# EAGLE design gertduino shield (EAGLE 7.5.0)
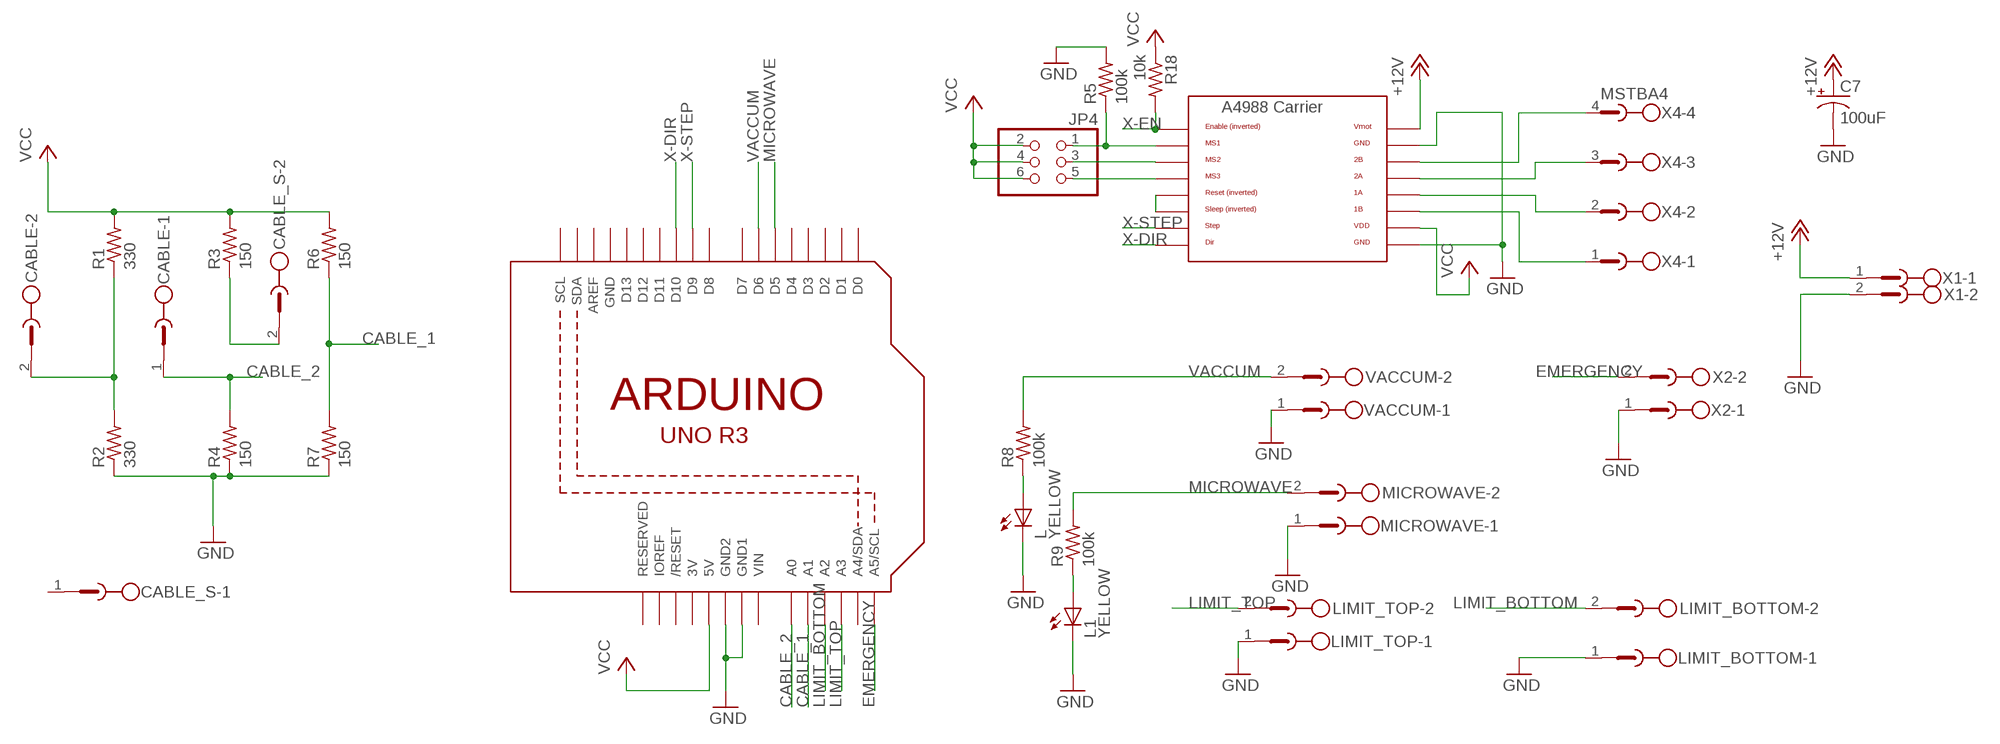
[diagram p0: schematic, sheet 1]

## Parts
C7  100uF  CPOL-US153CLV-0605  [153CLV-0605]
CABLE  MSTBV2  [MSTBV2]
CABLE_S  MSTBV2  [MSTBV2]
JP4  PINHD-2X3  [2X03]
L  YELLOW  LEDCHIP-LED0805  [CHIP-LED0805]
L1  YELLOW  LEDCHIP-LED0805  [CHIP-LED0805]
LIMIT_BOTTOM  MSTBV2  [MSTBV2]
LIMIT_TOP  MSTBV2  [MSTBV2]
MICROWAVE  MSTBV2  [MSTBV2]
R1  330  R-US_M0805  [M0805]
R2  330  R-US_M0805  [M0805]
R3  150  R-US_M0805  [M0805]
R4  150  R-US_M0805  [M0805]
R5  100k  R-US_R0805  [R0805]
R6  150  R-US_M0805  [M0805]
R7  150  R-US_M0805  [M0805]
R8  100k  R-US_R0805  [R0805]
R9  100k  R-US_R0805  [R0805]
R18  10k  R-US_R0805  [R0805]
U1  ARDUINOR3-DIMENSION  [ARDUINOR3]
U$6  A4988BREAKOUT  [A4988BREAKOUT]
VACCUM  MSTBV2  [MSTBV2]
X1  MSTBV2  [MSTBV2]
X2  MSTBV2  [MSTBV2]
X4  MSTBA4  [MSTBA4]

## Nets
+12V: C7.+ U$6.VMOT X1.1
CABLE_1: R6.1 R7.2 U1.A1
CABLE_2: CABLE.1 R4.2 U1.A0
EMERGENCY: U1.A5(A5/SCL) X2.2
GND: C7.- L1.C L.C LIMIT_BOTTOM.1 LIMIT_TOP.1 MICROWAVE.1 R2.1 R4.1 R5.2 R7.1 U1.GND1 U1.GND2 U$6.GND U$6.GND@0(GND) VACCUM.1 X1.2 X2.1
LIMIT_BOTTOM: LIMIT_BOTTOM.2 U1.A2
LIMIT_TOP: LIMIT_TOP.2 U1.A3
MICROWAVE: MICROWAVE.2 R9.2 U1.D5
N$1: L.A R8.1
N$2: L1.A R9.1
N$3: CABLE.2 R1.1 R2.2
N$5: CABLE_S.2 R3.1
N$14: JP4.1 R5.1 U$6.MS1
N$15: JP4.3 U$6.MS2
N$19: JP4.5 U$6.MS3
N$20: U$6.RST U$6.SLP(SLEEP)
N$21: U$6.2B X4.4
N$22: U$6.2A X4.3
N$26: U$6.1A X4.2
N$27: U$6.1B X4.1
VACCUM: R8.2 U1.D6 VACCUM.2
VCC: JP4.2 JP4.4 JP4.6 R1.2 R3.2 R6.2 R18.1 U1.5V U$6.VDD
X-DIR: U1.D10 U$6.DIR
X-EN: R18.2 U$6.EN
X-STEP: U1.D9 U$6.STEP
Unconnected: CABLE_S.1 U1.A4(A4/SDA) U1.AREF U1.D0 U1.D1 U1.D2 U1.D3 U1.D4 U1.D7 U1.D8 U1.D11 U1.D12 U1.D13 U1.IOREF U1.RESERVED U1.RESET(/RESET) U1.SCL U1.SDA

## Notes on the sheet
- X

## Power pins joined to a net without a drawn wire
3V: U1.3V
GND: U1.GND
VIN: U1.VIN

## Library data of the parts
C7 = adafruit:CPOL-US: POLARIZED CAPACITOR, American symbol
CABLE CABLE_S LIMIT_BOTTOM LIMIT_TOP MICROWAVE VACCUM X1 X2 = con-phoenix-500:MSTBV2: PHOENIX; OC_FARNELL: unknown; OC_NEWARK: unknown
JP4 = pinhead:PINHD-2X3: PIN HEADER
L L1 = led:LED: LED OSRAM: - CHIPLED LG R971, LG N971, LY N971, LG Q971, LY Q971, LO R971, LY R971 LH N974, LH R974 LS Q976, LO Q976, LY Q976 LO Q996 - Hyper CHIPLED LW Q18S LB Q993, LB Q99A, LB R99A - SideLED LS A670, LO A670, LY A670, LG A670, LP A670 LB A673, LV A673, LT A673, LW A673 LH A674 LY A675 LS A676, LA A676, LO A676, LY A676, LW A676 LS A679, LY A679, LG A679 - Hyper Micro SIDELED® LS Y876, LA Y876, LO Y876, LY Y876 LT Y87S - SmartLED LW L88C, LW L88S LB L89C, LB L89S, LG L890 LS L89K, LO L89K, LY L89K LS L896, LA L896, LO L896, LY L896 - TOPLED LS T670, LO T670, LY T670, LG T670, LP T670 LSG T670, LSP T670, LSY T670, LOP T670, LYG T670 LG T671, LOG T671, LSG T671 LB T673, LV T673, LT T673, LW T673 LH T674 LS T676, LA T676, LO T676, LY T676, LB T676, LH T676, LSB T676, LW T676 LB T67C, LV T67C, LT T67C, LS T67K, LO T67K, LY T67K, LW E67C LS E67B, LA E67B, LO E67B, LY E67B, LB E67C, LV E67C, LT E67C LW T67C LS T679, LY T679, LG T679 LS T770, LO T770, LY T770, LG T770, LP T770 LB T773, LV T773, LT T773, LW T773 LH T774 LS E675, LA E675, LY E675, LS T675 LS T776, LA T776, LO T776, LY T776, LB T776 LHGB T686 LT T68C, LB T68C - Hyper Mini TOPLED® LB M676 - Mini TOPLED Santana® LG M470 LS M47K, LO M47K, LY M47K Source: http://www.osram.convergy.de LUXEON: - LUMILED® LXK2-PW12-R00, LXK2-PW12-S00, LXK2-PW14-U00, LXK2-PW14-V00 LXK2-PM12-R00, LXK2-PM12-S00, LXK2-PM14-U00 LXK2-PE12-Q00, LXK2-PE12-R00, LXK2-PE12-S00, LXK2-PE14-T00, LXK2-PE14-U00 LXK2-PB12-K00, LXK2-PB12-L00, LXK2-PB12-M00, LXK2-PB14-N00, LXK2-PB14-P00, LXK2-PB14-Q00 LXK2-PR12-L00, LXK2-PR12-M00, LXK2-PR14-Q00, LXK2-PR14-R00 LXK2-PD12-Q00, LXK2-PD12-R00, LXK2-PD12-S00 LXK2-PH12-R00, LXK2-PH12-S00 LXK2-PL12-P00, LXK2-PL12-Q00, LXK2-PL12-R00 Source: www.luxeon.com KINGBRIGHT: KA-3528ASYC Source: www.kingbright.com
R1-R9 R18 = adafruit:R-US_: RESISTOR, American symbol
U1 = adafruit:ARDUINOR3: This is a new object for the new Arduino R3 - with extra pins that you may want to use (such as IOref, and duplicated A4/A5
U$6 = RepRapjr:A4988BREAKOUT
X4 = con-phoenix-508:MSTBA4: PHOENIX

## Net classes
0 default: width 0.152 mm, clearance 0.152 mm
2 gnd: width 0.203 mm, drill 0.559 mm, clearance 0.152 mm

## Board
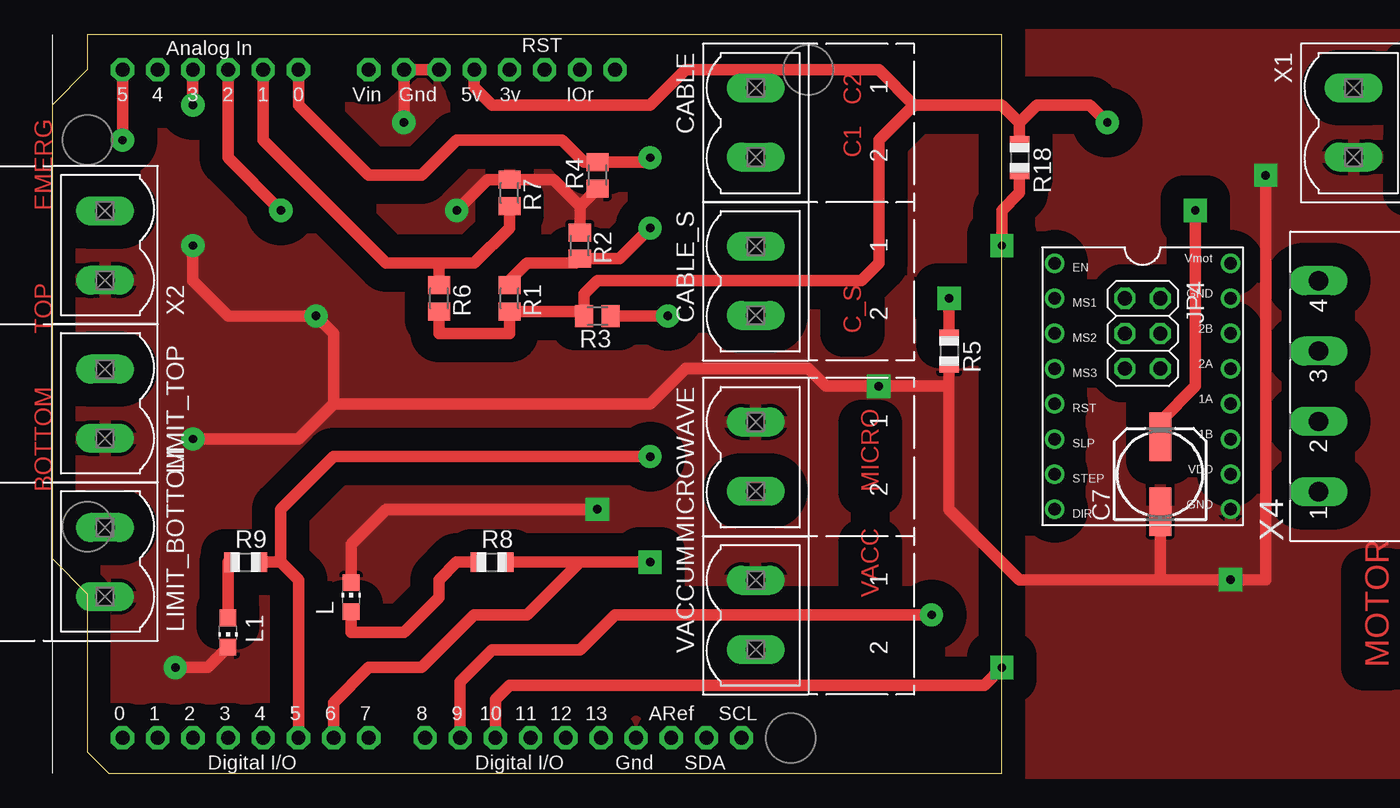
[diagram p1: board, top side]
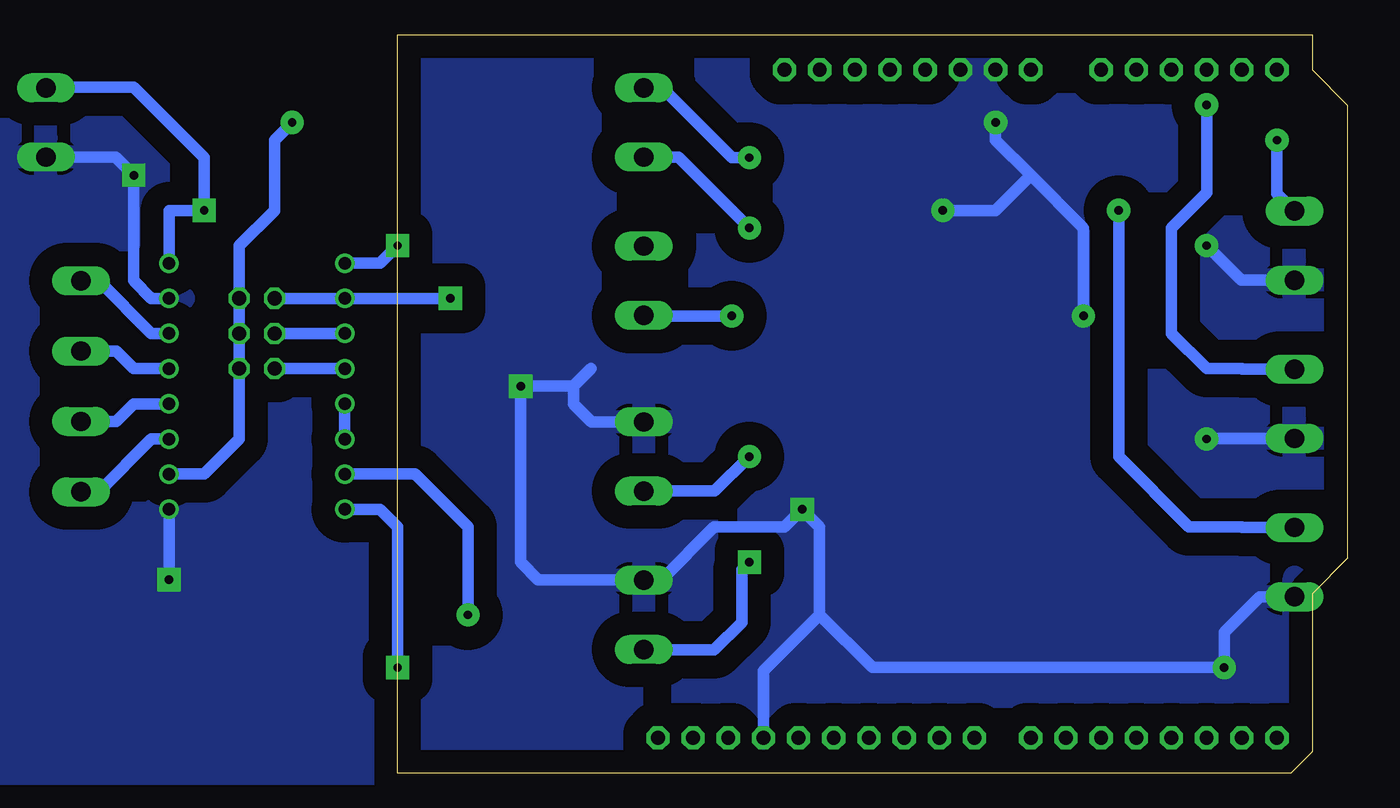
[diagram p2: board, bottom side, seen from below]

Size 68.58 x 53.34 mm. Coordinates in mm from the lower left corner, seen from the top.
Copper layers (1*16): Top 0.035mm / dielectric 1.5mm / Bottom 0.035mm
Design rules "default": minimum track width 10mil, minimum drill 24mil, track to track 8mil, track to pad 8mil, pad to pad 8mil, via to via 8mil, smd to smd 8mil, copper to edge 40mil, drill to drill 8mil, minimum pad ring 10mil, minimum via ring 8mil, stop-mask expansion 4mil, vias tented up to drill 0mil, thermal gap 10mil

### Footprints (pad centres in the part's own frame; a part is rotated, then mirrored left to right if it is on the bottom)
153CLV-0605 = smd 3.5 x 1.6: + 2.7,0; - -2.7,0
MSTBV2 = drill 1.397 long: 1 -2.5,0; 2 2.5,0
2X03 = drill 1.016 octagon: 1 -2.54,-1.27; 2 -2.54,1.27; 3 0,-1.27; 4 0,1.27; 5 2.54,-1.27; 6 2.54,1.27
CHIP-LED0805 = smd 1.2 x 1.2: A 0,-1.05; C 0,1.05
M0805 = smd 1.3 x 1.6: 1 -0.95,0; 2 0.95,0
R0805 = smd 1.1 x 1.4: 1 -1,0; 2 1,0
ARDUINOR3 = drill 1 pad 1.676 octagon: 3V 35.56,2.54; 5V 38.1,2.54; A0 50.8,2.54; A1 53.34,2.54; A2 55.88,2.54; A3 58.42,2.54; A4 60.96,2.54; A5 63.5,2.54; AREF 23.876,50.8; D0 63.5,50.8; D1 60.96,50.8; D2 58.42,50.8; D3 55.88,50.8; D4 53.34,50.8; D5 50.8,50.8; D6 48.26,50.8; D7 45.72,50.8; D8 41.656,50.8; D9 39.116,50.8; D10 36.576,50.8; D11 34.036,50.8; D12 31.496,50.8; D13 28.956,50.8; GND 26.416,50.8; GND1 43.18,2.54; GND2 40.64,2.54; IOREF 30.48,2.54; RESERVED 27.94,2.54; RESET 33.02,2.54; SCL 18.796,50.8; SDA 21.336,50.8; VIN 45.72,2.54
A4988BREAKOUT = drill 0.9: 1A 8.89,1.27; 1B 11.43,1.27; 2A 6.35,1.27; 2B 3.81,1.27; DIR 16.51,-11.43; EN -1.27,-11.43; GND 16.51,1.27; GND@0 1.27,1.27; MS1 1.27,-11.43; MS2 3.81,-11.43; MS3 6.35,-11.43; RST 8.89,-11.43; SLP 11.43,-11.43; STEP 13.97,-11.43; VDD 13.97,1.27; VMOT -1.27,1.27
MSTBA4 = drill 1.397 long: 1 -7.62,5.08; 2 -2.54,5.08; 3 2.54,5.08; 4 7.62,5.08

### Placement (x,y rotation side)
C7  80.01,21.59 90 top  (outside the outline)
CABLE  50.8,46.99 270 top
CABLE_S  50.8,35.56 270 top
JP4  78.74,31.75 270 top  (outside the outline)
L  21.59,12.7 0 top
L1  12.7,10.16 180 top
LIMIT_BOTTOM  3.81,15.24 90 top
LIMIT_TOP  3.81,26.67 90 top
MICROWAVE  50.8,22.86 270 top
R1  33.02,34.29 270 top
R2  38.1,38.1 270 top
R3  39.37,33.02 180 top
R4  39.37,43.18 90 top
R5  64.77,30.48 270 top
R6  27.94,34.29 270 top
R7  33.02,41.91 270 top
R8  31.75,15.24 0 top
R9  13.97,15.24 0 top
R18  69.85,44.45 270 top
U1  68.58,53.34 180 top
U$6  83.82,35.56 270 top  (outside the outline)
VACCUM  50.8,11.43 270 top
X1  93.98,46.99 270 top  (outside the outline)
X2  3.81,38.1 90 top
X4  96.52,27.94 90 top  (outside the outline)

### Tracks (layer width: path | path; a pad name or v marks a point on that pad's centre or on a via)
+12V  (via drill 0.6 pad 1.68)
  Top 0.813: C7.+ 80.01,25.4 82.55,27.94 v82.55,40.64
  Bottom 0.813: U$6.VMOT 85.09,40.64 v82.55,40.64 82.55,44.45 87.63,49.53 93.94,49.53 X1.1
CABLE_1
  Top 0.813: R7.2 33.02,39.37 30.48,36.83 27.94,36.83 | 27.94,36.83 R6.1 | U1.A1 15.24,45.72 24.13,36.83 27.94,36.83
CABLE_2  (via drill 0.6 pad 1.68)
  Top 0.813: v43.18,44.45 42.86,44.13 R4.2 38.42,44.13 36.83,45.72 29.21,45.72 26.67,43.18 22.86,43.18 17.78,48.26 U1.A0
  Bottom 0.813: v43.18,44.45 44.45,44.45 49.53,49.53 50.76,49.53 CABLE.1
EMERGENCY  (via drill 0.6 pad 1.68)
  Top 0.813: v5.08,45.72 U1.A5
  Bottom 0.813: v5.08,45.72 5.08,41.87 X2.2
GND  (via drill 0.6 pad 1.68)
  Top 0.813: C7.- 80.01,13.97 | 80.01,13.97 v85.09,13.97 87.63,13.97 v87.63,43.18 | R5.2 64.77,27.94 | 64.77,27.94 64.77,19.05 69.85,13.97 80.01,13.97 | v39.37,19.05 24.13,19.05 21.59,16.51 L.C | 64.77,27.94 v59.69,27.94 55.88,27.94 54.61,29.21 45.72,29.21 43.18,26.67 20.32,26.67 | L1.C 11.21,7.62 v8.89,7.62 | v25.4,46.99 U1.GND1 U1.GND2 | v10.16,24.13 17.78,24.13 20.32,26.67 | v10.16,38.1 10.16,35.56 12.7,33.02 v19.05,33.02 20.32,31.75 20.32,26.67 | R2.1 38.1,40.96 | 38.1,40.96 R4.1 | 38.1,40.96 36.2,42.86 R7.1 31.43,42.86 v29.21,40.64
  Bottom 0.813: v85.09,13.97 U$6.GND | U$6.GND@0 86.36,34.29 87.63,35.56 v87.63,43.18 88.94,44.49 X1.2 | 55.88,27.94 54.61,29.21 | U1.GND 42.16,7.37 38.1,11.43 | 38.1,11.43 38.1,17.78 v39.37,19.05 40.64,17.78 45.72,17.78 49.57,13.93 VACCUM.1 50.84,13.97 58.42,13.97 59.69,15.24 v59.69,27.94 55.88,27.94 | LIMIT_BOTTOM.1 6.31,12.74 8.89,10.16 v8.89,7.62 34.29,7.62 38.1,11.43 | MICROWAVE.1 54.57,25.36 55.88,26.67 55.88,27.94 | v25.4,46.99 25.4,45.72 22.86,43.18 | 22.86,43.18 19.05,39.37 v19.05,33.02 | LIMIT_TOP.1 10.12,24.17 v10.16,24.13 | X2.1 7.66,35.6 v10.16,38.1 | v29.21,40.64 25.4,40.64 22.86,43.18
  pour Bottom (isolate 1.676): 0,53.34 99.06,53.34 99.06,0 0,0
  pour Top (isolate 1.676): -1.27,53.34 100.33,53.34 100.33,0 -1.27,0
LIMIT_BOTTOM  (via drill 0.6 pad 1.68)
  Top 0.813: U1.A2 12.7,44.45 v16.51,40.64
  Bottom 0.813: LIMIT_BOTTOM.2 7.58,17.74 7.62,17.78 11.43,17.78 16.51,22.86 v16.51,40.64
LIMIT_TOP  (via drill 0.6 pad 1.68)
  Top 0.813: U1.A3 v10.16,48.26
  Bottom 0.813: v10.16,48.26 10.16,41.91 12.7,39.37 12.7,31.75 10.16,29.21 7.62,29.21 7.58,29.17 LIMIT_TOP.2
MICROWAVE  (via drill 0.6 pad 1.68)
  Top 0.813: U1.D5 17.78,13.97 16.51,15.24 | R9.2 16.51,15.24 | v43.18,22.86 20.32,22.86 16.51,19.05 16.51,15.24
  Bottom 0.813: MICROWAVE.2 45.68,20.36 v43.18,22.86
N$1
  Top 0.813: L.A 21.59,10.16 25.4,10.16 27.94,12.7 27.94,13.97 29.21,15.24 R8.1
N$2
  Top 0.813: L1.A 12.7,15.24 R9.1
N$3  (via drill 0.6 pad 1.68)
  Top 0.813: v43.18,39.37 40.96,37.15 R2.2 37.78,36.83 34.29,36.83 33.02,35.56 R1.1
  Bottom 0.813: CABLE.2 48.3,44.49 v43.18,39.37
N$5  (via drill 0.6 pad 1.68)
  Top 0.813: R3.1 v44.45,33.02
  Bottom 0.813: v44.45,33.02 50.76,33.02 CABLE_S.2
N$14  (via drill 0.6 pad 1.68)
  Top 0.813: v64.77,34.29 R5.1
  Bottom 0.813: JP4.1 U$6.MS1 v64.77,34.29
N$15
  Bottom 0.813: JP4.3 U$6.MS2
N$19
  Bottom 0.813: JP4.5 U$6.MS3
N$20
  Bottom 0.813: U$6.RST U$6.SLP
N$21
  Bottom 0.813: U$6.2B 86.36,31.75 90.17,35.56 X4.4
N$22
  Bottom 0.813: U$6.2A 87.63,29.21 88.9,30.48 X4.3
N$26
  Bottom 0.813: U$6.1A 87.63,26.67 88.9,25.4 X4.2
N$27
  Bottom 0.813: U$6.1B 86.36,24.13 90.17,20.32 X4.1
VACCUM  (via drill 0.6 pad 1.68)
  Top 0.813: U1.D6 20.32,5.08 22.86,7.62 26.67,7.62 30.48,11.43 34.29,11.43 38.1,15.24 | R8.2 38.1,15.24 | v43.18,15.24 38.1,15.24
  Bottom 0.813: v43.18,15.24 43.71,14.71 43.71,10.9 45.72,8.89 50.76,8.89 VACCUM.2
VCC  (via drill 0.6 pad 1.68)
  Top 0.813: R6.2 27.94,31.75 33.02,31.75 R1.2 38.1,33.34 R3.2 38.42,34.61 39.37,35.56 58.42,35.56 59.69,36.83 59.69,45.72 62.23,48.26 | 62.23,48.26 68.58,48.26 69.85,46.99 | 69.85,46.99 R18.1 | v76.2,46.99 74.93,48.26 71.12,48.26 69.85,46.99 | U1.5V 30.48,49.53 31.75,48.26 43.18,48.26 45.72,50.8 59.69,50.8 62.23,48.26
  Bottom 0.813: U$6.VDD 82.55,21.59 80.01,24.13 JP4.6 JP4.4 JP4.2 80.01,38.1 77.47,40.64 77.47,45.72 v76.2,46.99
X-DIR  (via drill 0.6 pad 1.68)
  Top 0.813: U1.D10 32,5.33 33.02,6.35 67.31,6.35 v68.58,7.62
  Bottom 0.813: v68.58,7.62 68.58,17.78 69.85,19.05 U$6.DIR
X-EN  (via drill 0.6 pad 1.68)
  Top 0.813: v68.58,38.1 68.58,40.64 69.85,41.91 R18.2
  Bottom 0.813: U$6.EN 69.85,36.83 v68.58,38.1
X-STEP  (via drill 0.6 pad 1.68)
  Top 0.813: U1.D9 29.46,6.6 31.75,8.89 38.1,8.89 40.64,11.43 v63.5,11.43
  Bottom 0.813: v63.5,11.43 63.5,17.78 67.31,21.59 U$6.STEP

### Text on the board
Top: C2 | GND | C1 | 12V+ | EMERG | TOP | C_S | BOTTOM | MICRO | VACC | MOTOR